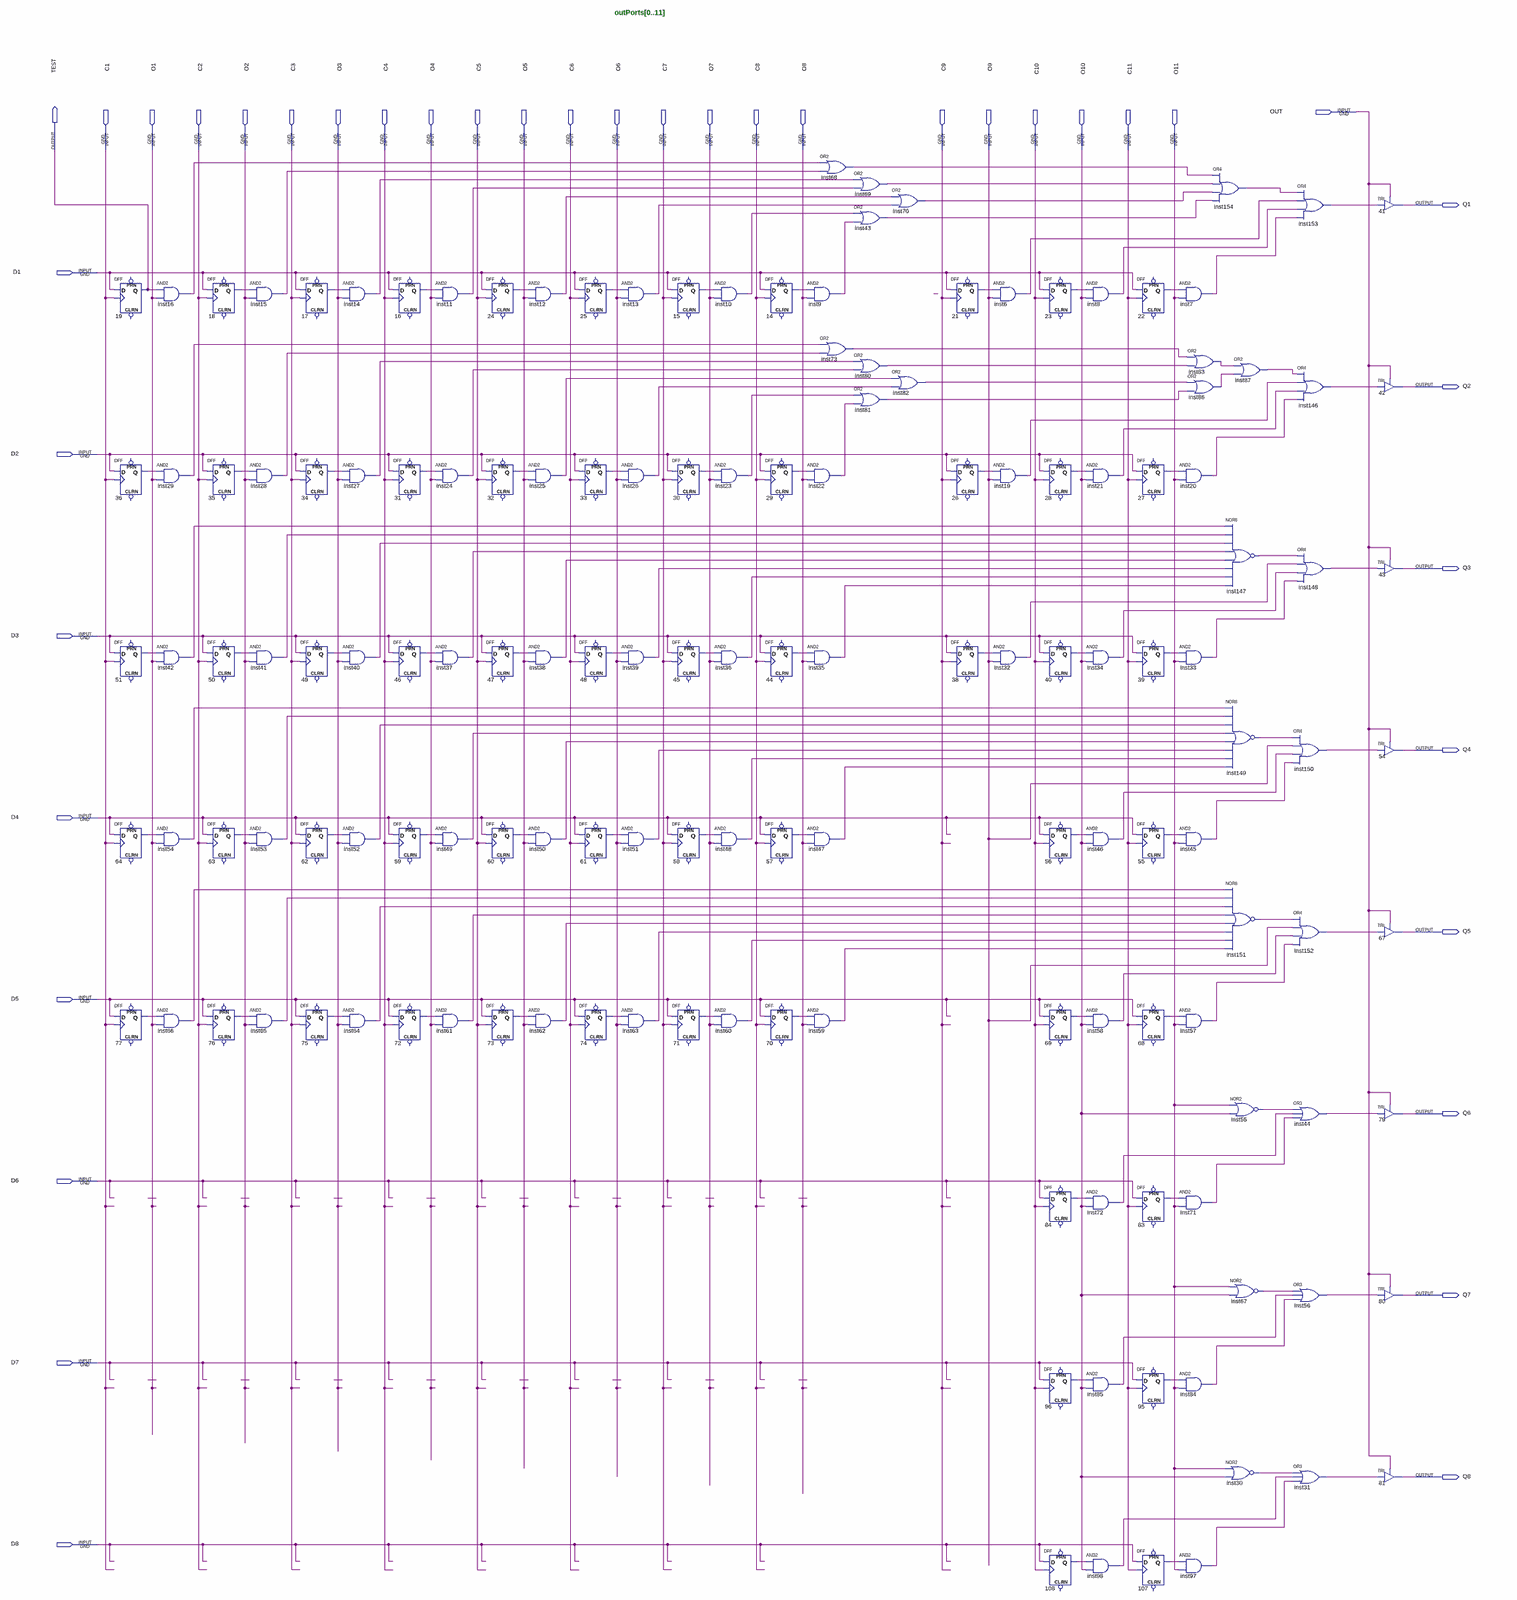
[diagram p0: schematic sheet, whole]
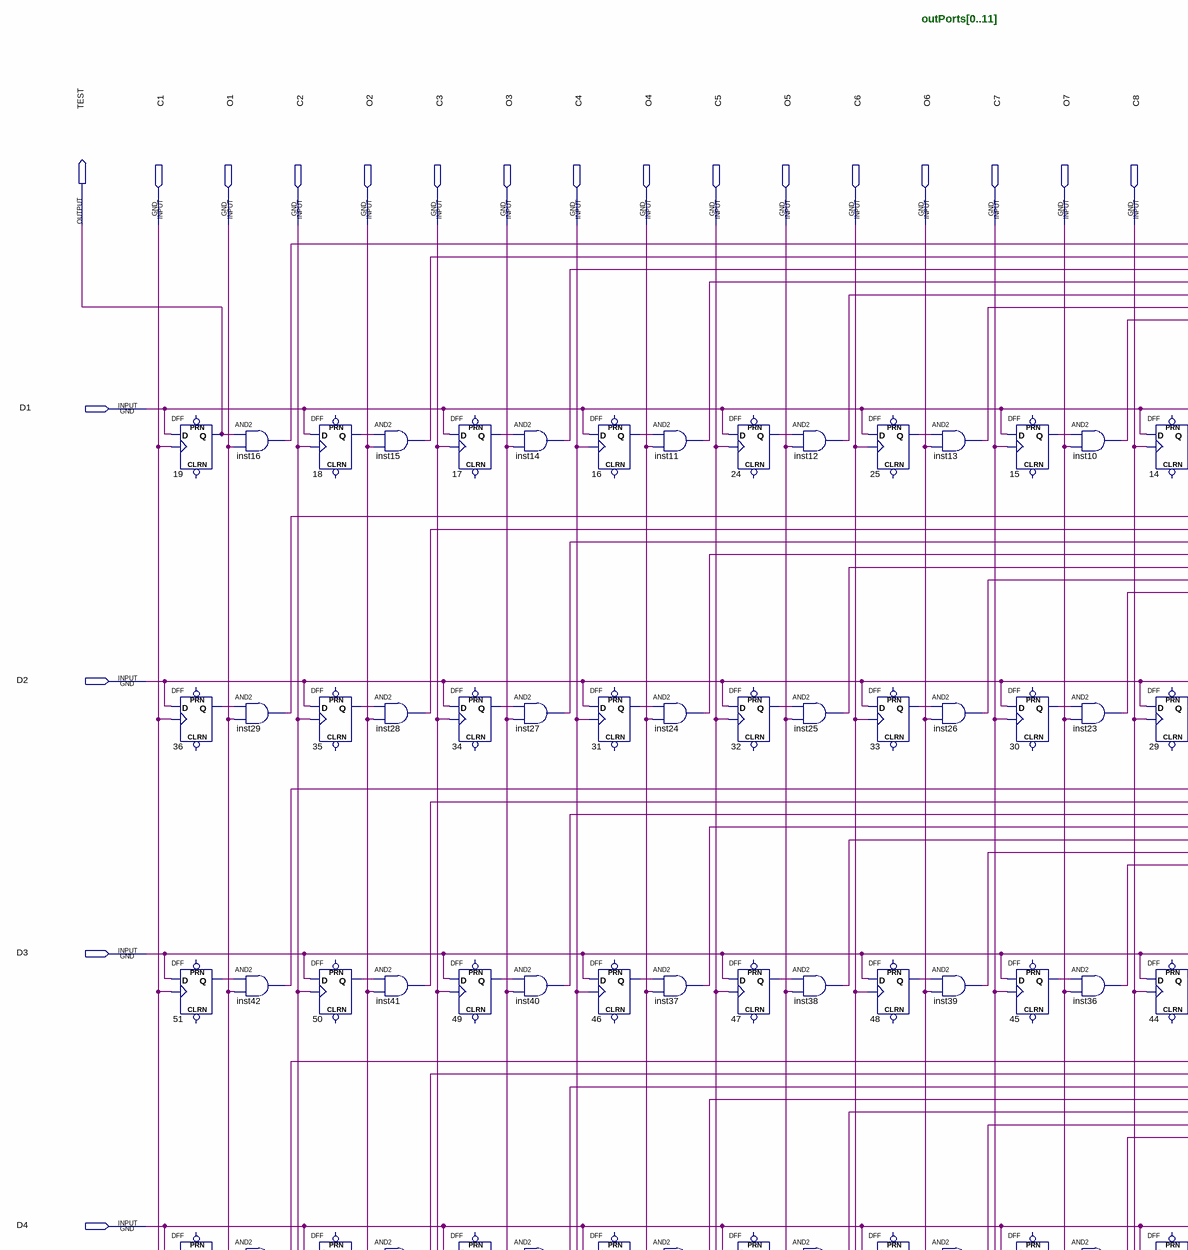
[diagram p1: schematic sheet, upper left part]
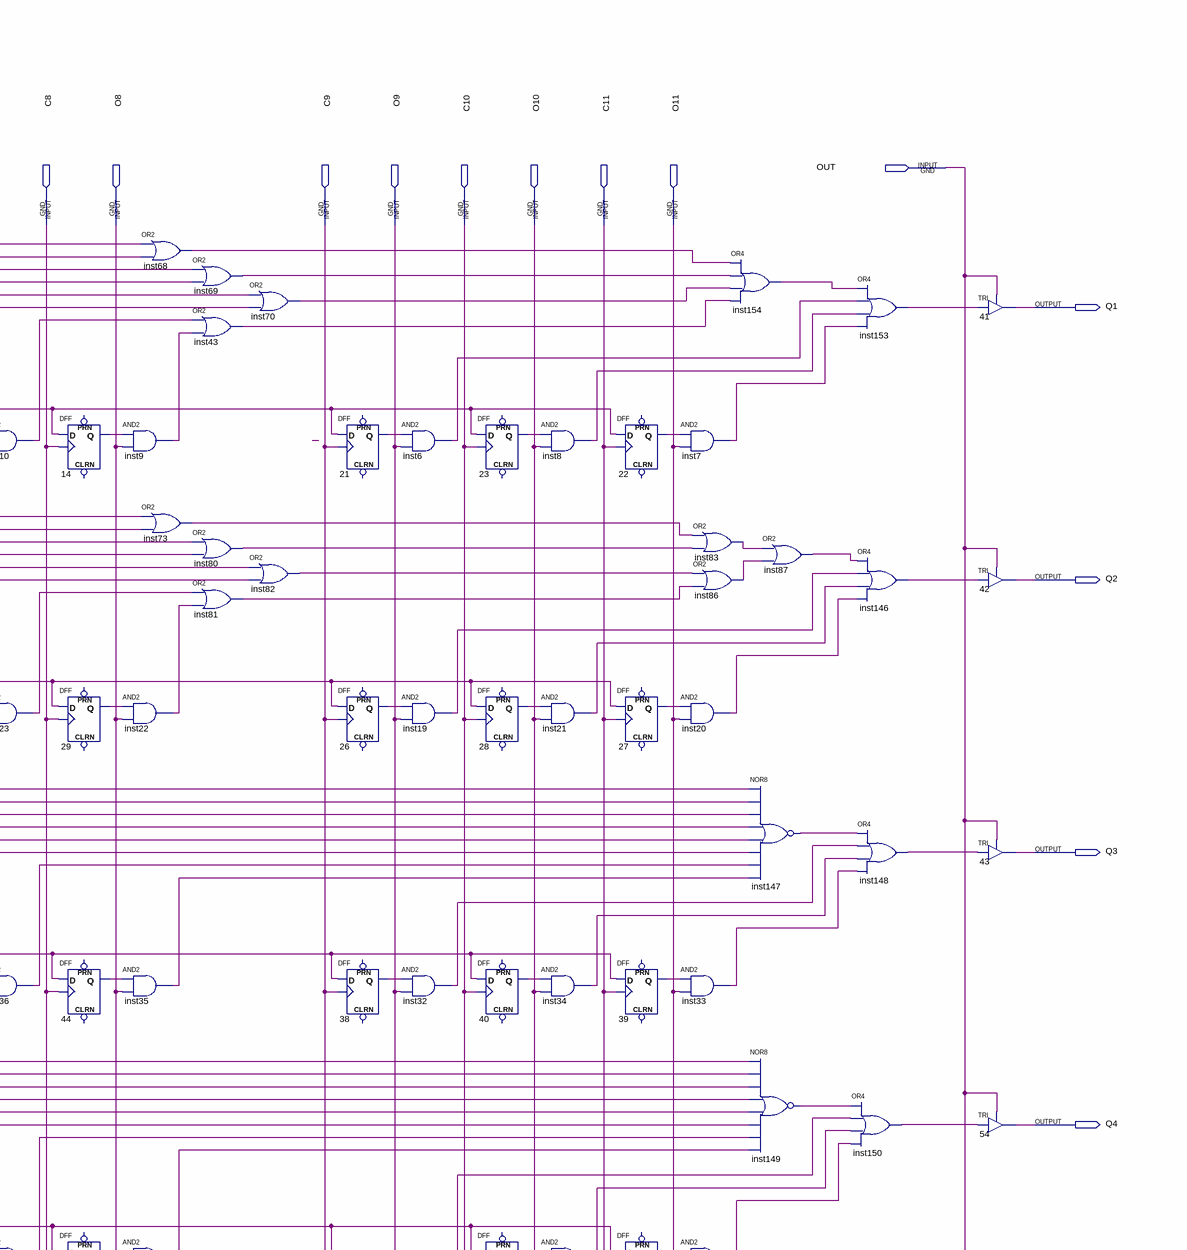
[diagram p2: schematic sheet, upper right part]
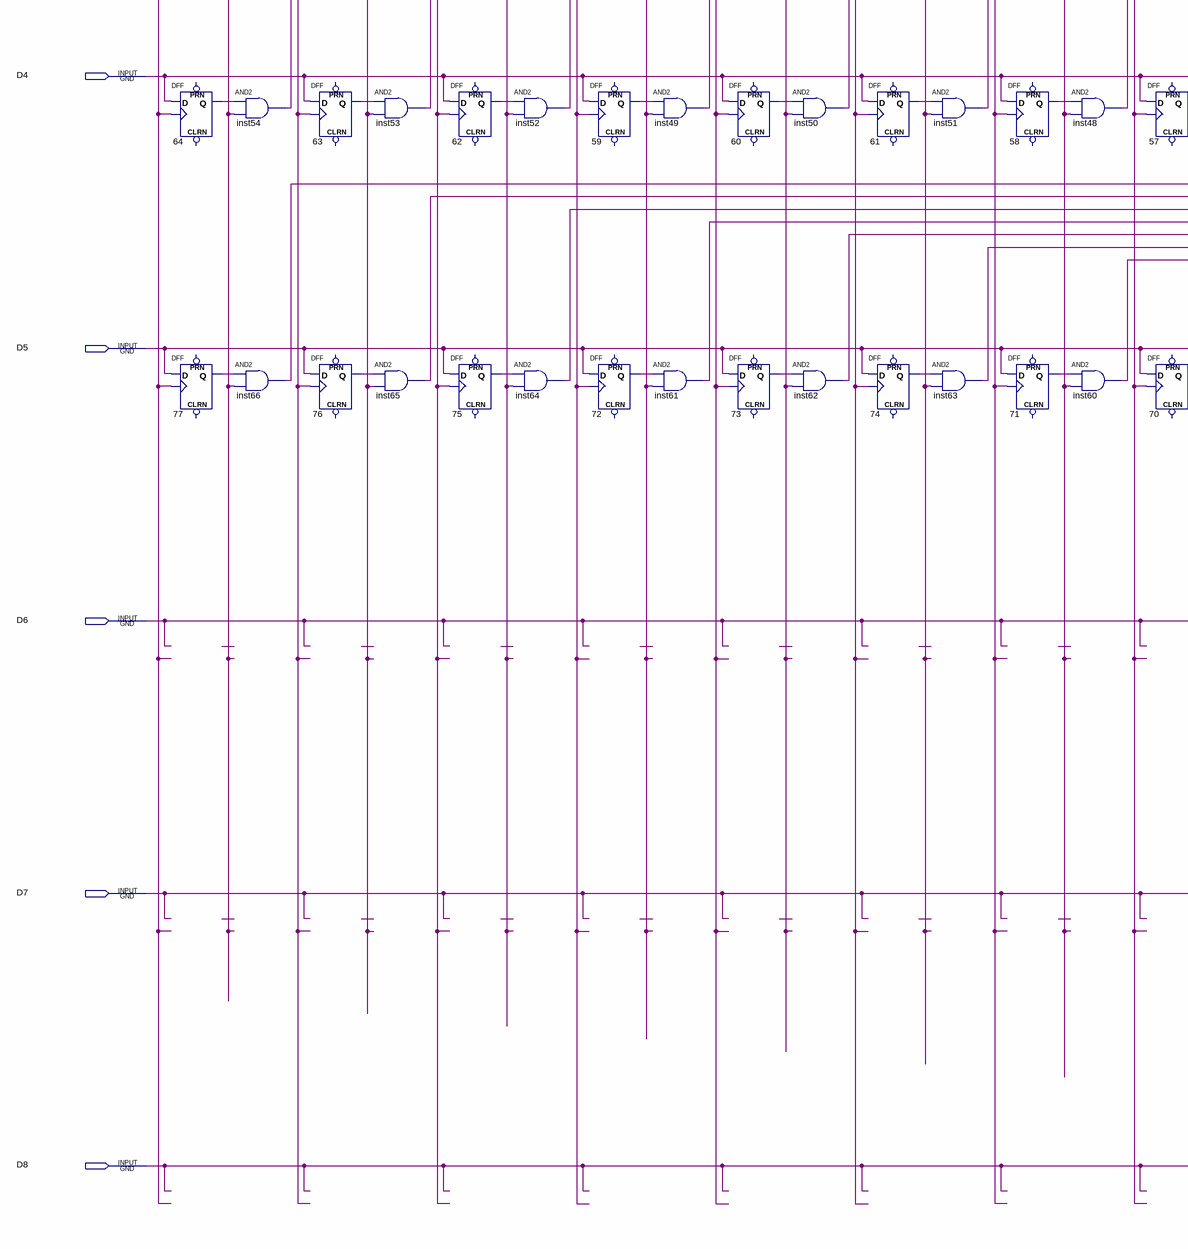
[diagram p3: schematic sheet, lower left part]
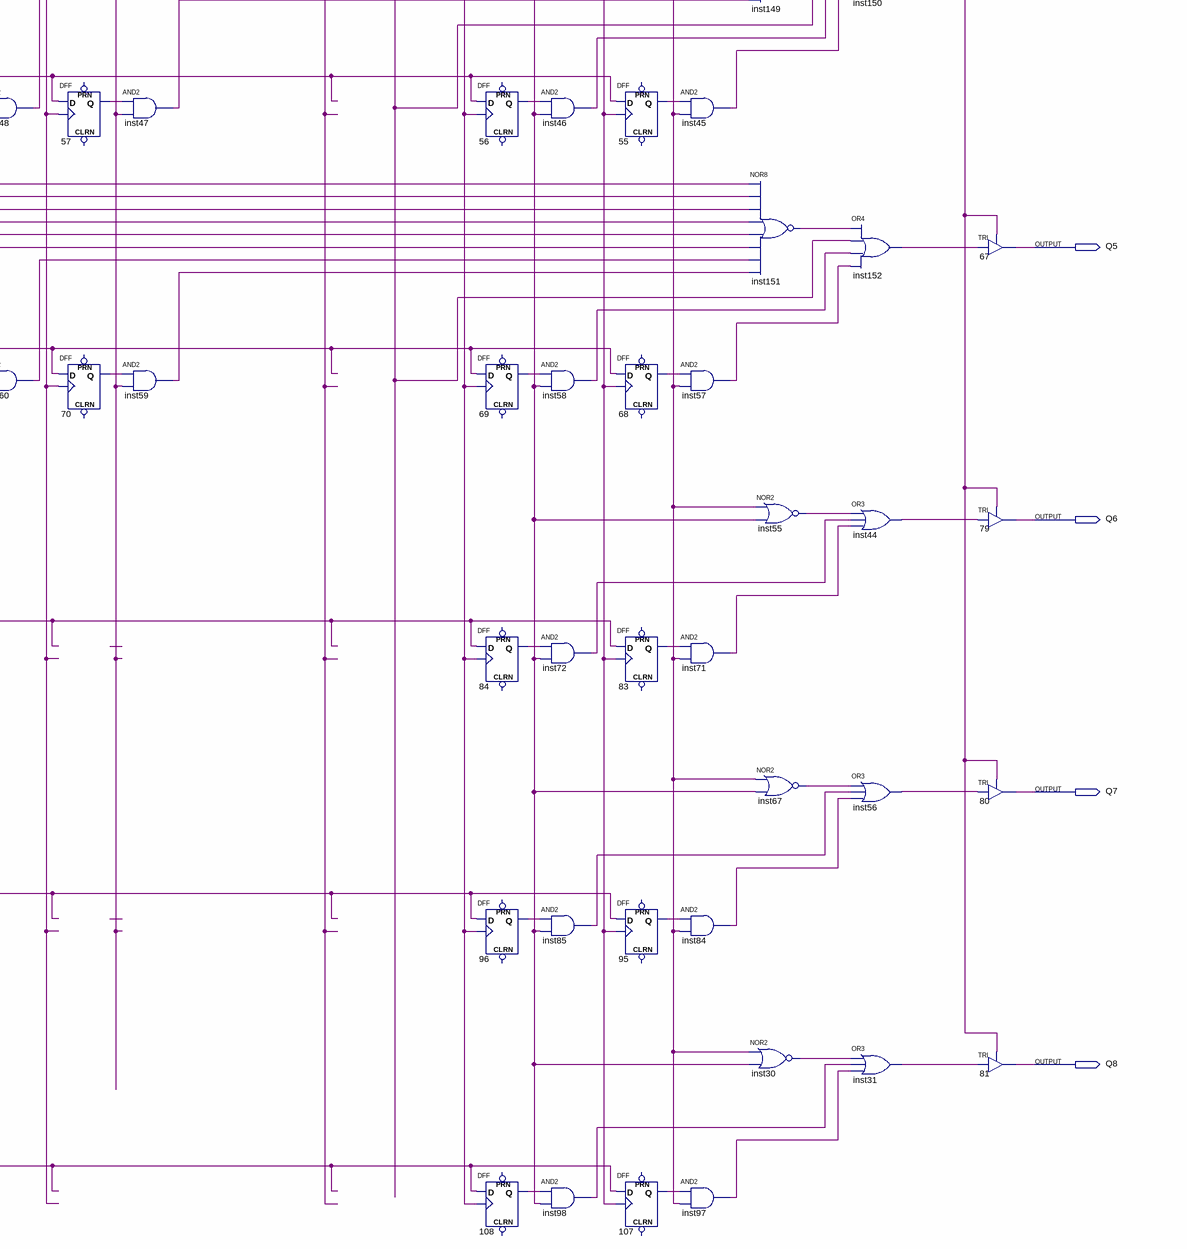
[diagram p4: schematic sheet, lower right part]
// Quartus schematic register_kbg.bdf as structural Verilog: 152 symbols, 40 pins
module register_kbg (
  input  OUT,
  input  C1,
  input  O1,
  input  C2,
  input  O2,
  input  C3,
  input  O3,
  input  C4,
  input  O4,
  input  C5,
  input  O5,
  input  C6,
  input  O6,
  input  C7,
  input  O7,
  input  C8,
  input  O8,
  input  C9,
  input  O9,
  input  C10,
  input  O10,
  input  C11,
  input  O11,
  input  D1,
  input  D2,
  input  D3,
  input  D4,
  input  D5,
  input  D6,
  input  D7,
  input  D8,
  output TEST,
  output Q1,
  output Q2,
  output Q3,
  output Q4,
  output Q5,
  output Q6,
  output Q7,
  output Q8
);

  wire inst6_out, inst7_out, inst8_out, inst9_out, inst10_out, inst11_out, inst12_out, inst13_out,
       inst14_out, inst15_out, inst16_out, inst19_out, inst20_out, inst21_out, inst22_out, inst23_out,
       inst24_out, inst25_out, inst26_out, inst27_out, inst28_out, inst29_out, inst30_out, inst31_out,
       inst32_out, inst33_out, inst34_out, inst35_out, inst36_out, inst37_out, inst38_out, inst39_out,
       inst40_out, inst41_out, inst42_out, inst43_out, inst44_out, inst45_out, inst46_out, inst47_out,
       inst48_out, inst49_out, inst50_out, inst51_out, inst52_out, inst53_out, inst54_out, inst55_out,
       inst56_out, inst57_out, inst58_out, inst59_out, inst60_out, inst61_out, inst62_out, inst63_out,
       inst64_out, inst65_out, inst66_out, inst67_out, inst68_out, inst69_out, inst70_out, inst71_out,
       inst72_out, inst73_out, inst80_out, inst81_out, inst82_out, inst83_out, inst84_out, inst85_out,
       inst86_out, inst87_out, inst97_out, inst98_out, inst146_out, inst147_out, inst148_out, inst149_out,
       inst150_out, inst151_out, inst152_out, inst153_out, inst154_out, n14_q, n15_q, n16_q, n17_q, n18_q,
       n21_q, n22_q, n23_q, n24_q, n25_q, n26_q, n27_q, n28_q, n29_q, n30_q, n31_q, n32_q, n33_q, n34_q,
       n35_q, n36_q, n38_q, n39_q, n40_q, n44_q, n45_q, n46_q, n47_q, n48_q, n49_q, n50_q, n51_q, n55_q,
       n56_q, n57_q, n58_q, n59_q, n60_q, n61_q, n62_q, n63_q, n64_q, n68_q, n69_q, n70_q, n71_q, n72_q,
       n73_q, n74_q, n75_q, n76_q, n77_q, n83_q, n84_q, n95_q, n96_q, n107_q, n108_q;

  DFF u_19 (.CLK(C1), .D(D1), .Q(TEST));  // open: CLRN, PRN
  DFF u_36 (.CLK(C1), .D(D2), .Q(n36_q));  // open: CLRN, PRN
  DFF u_51 (.CLK(C1), .D(D3), .Q(n51_q));  // open: CLRN, PRN
  DFF u_64 (.CLK(C1), .D(D4), .Q(n64_q));  // open: CLRN, PRN
  DFF u_77 (.CLK(C1), .D(D5), .Q(n77_q));  // open: CLRN, PRN
  and inst16 (inst16_out, TEST, O1);
  and inst29 (inst29_out, n36_q, O1);
  and inst42 (inst42_out, n51_q, O1);
  and inst54 (inst54_out, n64_q, O1);
  and inst66 (inst66_out, n77_q, O1);
  DFF u_18 (.CLK(C2), .D(D1), .Q(n18_q));  // open: CLRN, PRN
  DFF u_35 (.CLK(C2), .D(D2), .Q(n35_q));  // open: CLRN, PRN
  DFF u_50 (.CLK(C2), .D(D3), .Q(n50_q));  // open: CLRN, PRN
  DFF u_63 (.CLK(C2), .D(D4), .Q(n63_q));  // open: CLRN, PRN
  DFF u_76 (.CLK(C2), .D(D5), .Q(n76_q));  // open: CLRN, PRN
  and inst15 (inst15_out, n18_q, O2);
  and inst28 (inst28_out, n35_q, O2);
  and inst41 (inst41_out, n50_q, O2);
  and inst53 (inst53_out, n63_q, O2);
  and inst65 (inst65_out, n76_q, O2);
  DFF u_17 (.CLK(C3), .D(D1), .Q(n17_q));  // open: CLRN, PRN
  DFF u_34 (.CLK(C3), .D(D2), .Q(n34_q));  // open: CLRN, PRN
  DFF u_49 (.CLK(C3), .D(D3), .Q(n49_q));  // open: CLRN, PRN
  DFF u_62 (.CLK(C3), .D(D4), .Q(n62_q));  // open: CLRN, PRN
  DFF u_75 (.CLK(C3), .D(D5), .Q(n75_q));  // open: CLRN, PRN
  and inst14 (inst14_out, n17_q, O3);
  and inst27 (inst27_out, n34_q, O3);
  and inst40 (inst40_out, n49_q, O3);
  and inst52 (inst52_out, n62_q, O3);
  and inst64 (inst64_out, n75_q, O3);
  DFF u_16 (.CLK(C4), .D(D1), .Q(n16_q));  // open: CLRN, PRN
  DFF u_31 (.CLK(C4), .D(D2), .Q(n31_q));  // open: CLRN, PRN
  DFF u_46 (.CLK(C4), .D(D3), .Q(n46_q));  // open: CLRN, PRN
  DFF u_59 (.CLK(C4), .D(D4), .Q(n59_q));  // open: CLRN, PRN
  DFF u_72 (.CLK(C4), .D(D5), .Q(n72_q));  // open: CLRN, PRN
  and inst11 (inst11_out, n16_q, O4);
  and inst24 (inst24_out, n31_q, O4);
  and inst37 (inst37_out, n46_q, O4);
  and inst49 (inst49_out, n59_q, O4);
  and inst61 (inst61_out, n72_q, O4);
  DFF u_24 (.CLK(C5), .D(D1), .Q(n24_q));  // open: CLRN, PRN
  DFF u_32 (.CLK(C5), .D(D2), .Q(n32_q));  // open: CLRN, PRN
  DFF u_47 (.CLK(C5), .D(D3), .Q(n47_q));  // open: CLRN, PRN
  DFF u_60 (.CLK(C5), .D(D4), .Q(n60_q));  // open: CLRN, PRN
  DFF u_73 (.CLK(C5), .D(D5), .Q(n73_q));  // open: CLRN, PRN
  and inst12 (inst12_out, n24_q, O5);
  and inst25 (inst25_out, n32_q, O5);
  and inst38 (inst38_out, n47_q, O5);
  and inst50 (inst50_out, n60_q, O5);
  and inst62 (inst62_out, n73_q, O5);
  DFF u_25 (.CLK(C6), .D(D1), .Q(n25_q));  // open: CLRN, PRN
  DFF u_33 (.CLK(C6), .D(D2), .Q(n33_q));  // open: CLRN, PRN
  DFF u_48 (.CLK(C6), .D(D3), .Q(n48_q));  // open: CLRN, PRN
  DFF u_61 (.CLK(C6), .D(D4), .Q(n61_q));  // open: CLRN, PRN
  DFF u_74 (.CLK(C6), .D(D5), .Q(n74_q));  // open: CLRN, PRN
  and inst13 (inst13_out, n25_q, O6);
  and inst26 (inst26_out, n33_q, O6);
  and inst39 (inst39_out, n48_q, O6);
  and inst51 (inst51_out, n61_q, O6);
  and inst63 (inst63_out, n74_q, O6);
  DFF u_15 (.CLK(C7), .D(D1), .Q(n15_q));  // open: CLRN, PRN
  DFF u_30 (.CLK(C7), .D(D2), .Q(n30_q));  // open: CLRN, PRN
  DFF u_45 (.CLK(C7), .D(D3), .Q(n45_q));  // open: CLRN, PRN
  DFF u_58 (.CLK(C7), .D(D4), .Q(n58_q));  // open: CLRN, PRN
  DFF u_71 (.CLK(C7), .D(D5), .Q(n71_q));  // open: CLRN, PRN
  and inst10 (inst10_out, n15_q, O7);
  and inst23 (inst23_out, n30_q, O7);
  and inst36 (inst36_out, n45_q, O7);
  and inst48 (inst48_out, n58_q, O7);
  and inst60 (inst60_out, n71_q, O7);
  DFF u_14 (.CLK(C8), .D(D1), .Q(n14_q));  // open: CLRN, PRN
  DFF u_29 (.CLK(C8), .D(D2), .Q(n29_q));  // open: CLRN, PRN
  DFF u_44 (.CLK(C8), .D(D3), .Q(n44_q));  // open: CLRN, PRN
  DFF u_57 (.CLK(C8), .D(D4), .Q(n57_q));  // open: CLRN, PRN
  DFF u_70 (.CLK(C8), .D(D5), .Q(n70_q));  // open: CLRN, PRN
  or inst68 (inst68_out, inst16_out, inst15_out);
  and inst9 (inst9_out, n14_q, O8);
  or inst73 (inst73_out, inst29_out, inst28_out);
  and inst22 (inst22_out, n29_q, O8);
  and inst35 (inst35_out, n44_q, O8);
  and inst47 (inst47_out, n57_q, O8);
  and inst59 (inst59_out, n70_q, O8);
  or inst69 (inst69_out, inst14_out, inst11_out);
  or inst43 (inst43_out, inst10_out, inst9_out);
  or inst80 (inst80_out, inst27_out, inst24_out);
  or inst81 (inst81_out, inst23_out, inst22_out);
  or inst70 (inst70_out, inst12_out, inst13_out);
  or inst82 (inst82_out, inst25_out, inst26_out);
  DFF u_21 (.CLK(C9), .D(D1), .Q(n21_q));  // open: CLRN, PRN
  DFF u_26 (.CLK(C9), .D(D2), .Q(n26_q));  // open: CLRN, PRN
  DFF u_38 (.CLK(C9), .D(D3), .Q(n38_q));  // open: CLRN, PRN
  and inst6 (inst6_out, n21_q, O9);
  and inst19 (inst19_out, n26_q, O9);
  and inst32 (inst32_out, n38_q, O9);
  DFF u_23 (.CLK(C10), .D(D1), .Q(n23_q));  // open: CLRN, PRN
  DFF u_28 (.CLK(C10), .D(D2), .Q(n28_q));  // open: CLRN, PRN
  DFF u_40 (.CLK(C10), .D(D3), .Q(n40_q));  // open: CLRN, PRN
  DFF u_56 (.CLK(C10), .D(D4), .Q(n56_q));  // open: CLRN, PRN
  DFF u_69 (.CLK(C10), .D(D5), .Q(n69_q));  // open: CLRN, PRN
  DFF u_84 (.CLK(C10), .D(D6), .Q(n84_q));  // open: CLRN, PRN
  DFF u_96 (.CLK(C10), .D(D7), .Q(n96_q));  // open: CLRN, PRN
  DFF u_108 (.CLK(C10), .D(D8), .Q(n108_q));  // open: CLRN, PRN
  and inst8 (inst8_out, n23_q, O10);
  and inst21 (inst21_out, n28_q, O10);
  and inst34 (inst34_out, n40_q, O10);
  and inst46 (inst46_out, n56_q, O10);
  and inst58 (inst58_out, n69_q, O10);
  and inst72 (inst72_out, n84_q, O10);
  and inst85 (inst85_out, n96_q, O10);
  and inst98 (inst98_out, n108_q, O10);
  DFF u_22 (.CLK(C11), .D(D1), .Q(n22_q));  // open: CLRN, PRN
  DFF u_27 (.CLK(C11), .D(D2), .Q(n27_q));  // open: CLRN, PRN
  DFF u_39 (.CLK(C11), .D(D3), .Q(n39_q));  // open: CLRN, PRN
  DFF u_55 (.CLK(C11), .D(D4), .Q(n55_q));  // open: CLRN, PRN
  DFF u_68 (.CLK(C11), .D(D5), .Q(n68_q));  // open: CLRN, PRN
  DFF u_83 (.CLK(C11), .D(D6), .Q(n83_q));  // open: CLRN, PRN
  DFF u_95 (.CLK(C11), .D(D7), .Q(n95_q));  // open: CLRN, PRN
  DFF u_107 (.CLK(C11), .D(D8), .Q(n107_q));  // open: CLRN, PRN
  and inst7 (inst7_out, n22_q, O11);
  or inst83 (inst83_out, inst73_out, inst80_out);
  or inst86 (inst86_out, inst82_out, inst81_out);
  and inst20 (inst20_out, n27_q, O11);
  and inst33 (inst33_out, n39_q, O11);
  and inst45 (inst45_out, n55_q, O11);
  and inst57 (inst57_out, n68_q, O11);
  and inst71 (inst71_out, n83_q, O11);
  and inst84 (inst84_out, n95_q, O11);
  and inst97 (inst97_out, n107_q, O11);
  or inst154 (inst154_out, inst68_out, inst69_out, inst70_out, inst43_out);
  or inst87 (inst87_out, inst83_out, inst86_out);
  nor inst147 (inst147_out, inst42_out, inst41_out, inst40_out, inst37_out, inst38_out, inst39_out, inst36_out, inst35_out);
  nor inst149 (inst149_out, inst54_out, inst53_out, inst52_out, inst49_out, inst50_out, inst51_out, inst48_out, inst47_out);
  nor inst151 (inst151_out, inst66_out, inst65_out, inst64_out, inst61_out, inst62_out, inst63_out, inst60_out, inst59_out);
  nor inst55 (inst55_out, O11, O10);
  nor inst67 (inst67_out, O11, O10);
  nor inst30 (inst30_out, O11, O10);
  or inst153 (inst153_out, inst154_out, inst6_out, inst8_out, inst7_out);
  or inst146 (inst146_out, inst87_out, inst19_out, inst21_out, inst20_out);
  or inst148 (inst148_out, inst147_out, inst32_out, inst34_out, inst33_out);
  or inst150 (inst150_out, inst149_out, O9, inst46_out, inst45_out);
  or inst152 (inst152_out, inst151_out, O9, inst58_out, inst57_out);
  or inst44 (inst44_out, inst55_out, inst72_out, inst71_out);
  or inst56 (inst56_out, inst67_out, inst85_out, inst84_out);
  or inst31 (inst31_out, inst30_out, inst98_out, inst97_out);
  TRI u_41 (.IN(inst153_out), .OE(OUT), .OUT(Q1));
  TRI u_42 (.IN(inst146_out), .OE(OUT), .OUT(Q2));
  TRI u_43 (.IN(inst148_out), .OE(OUT), .OUT(Q3));
  TRI u_54 (.IN(inst150_out), .OE(OUT), .OUT(Q4));
  TRI u_67 (.IN(inst152_out), .OE(OUT), .OUT(Q5));
  TRI u_79 (.IN(inst44_out), .OE(OUT), .OUT(Q6));
  TRI u_80 (.IN(inst56_out), .OE(OUT), .OUT(Q7));
  TRI u_81 (.IN(inst31_out), .OE(OUT), .OUT(Q8));

  // Notes on the sheet:
  //   outPorts[0..11]
endmodule
